# Altium project iMX6 Rex_V1I1.PrjPcb (part 3 of 3)

## Sheet [12] - CPU - UNUSED.SchDoc
size A2; DocumentNumber: 12; SheetNumber: 12; SheetTotal: 20
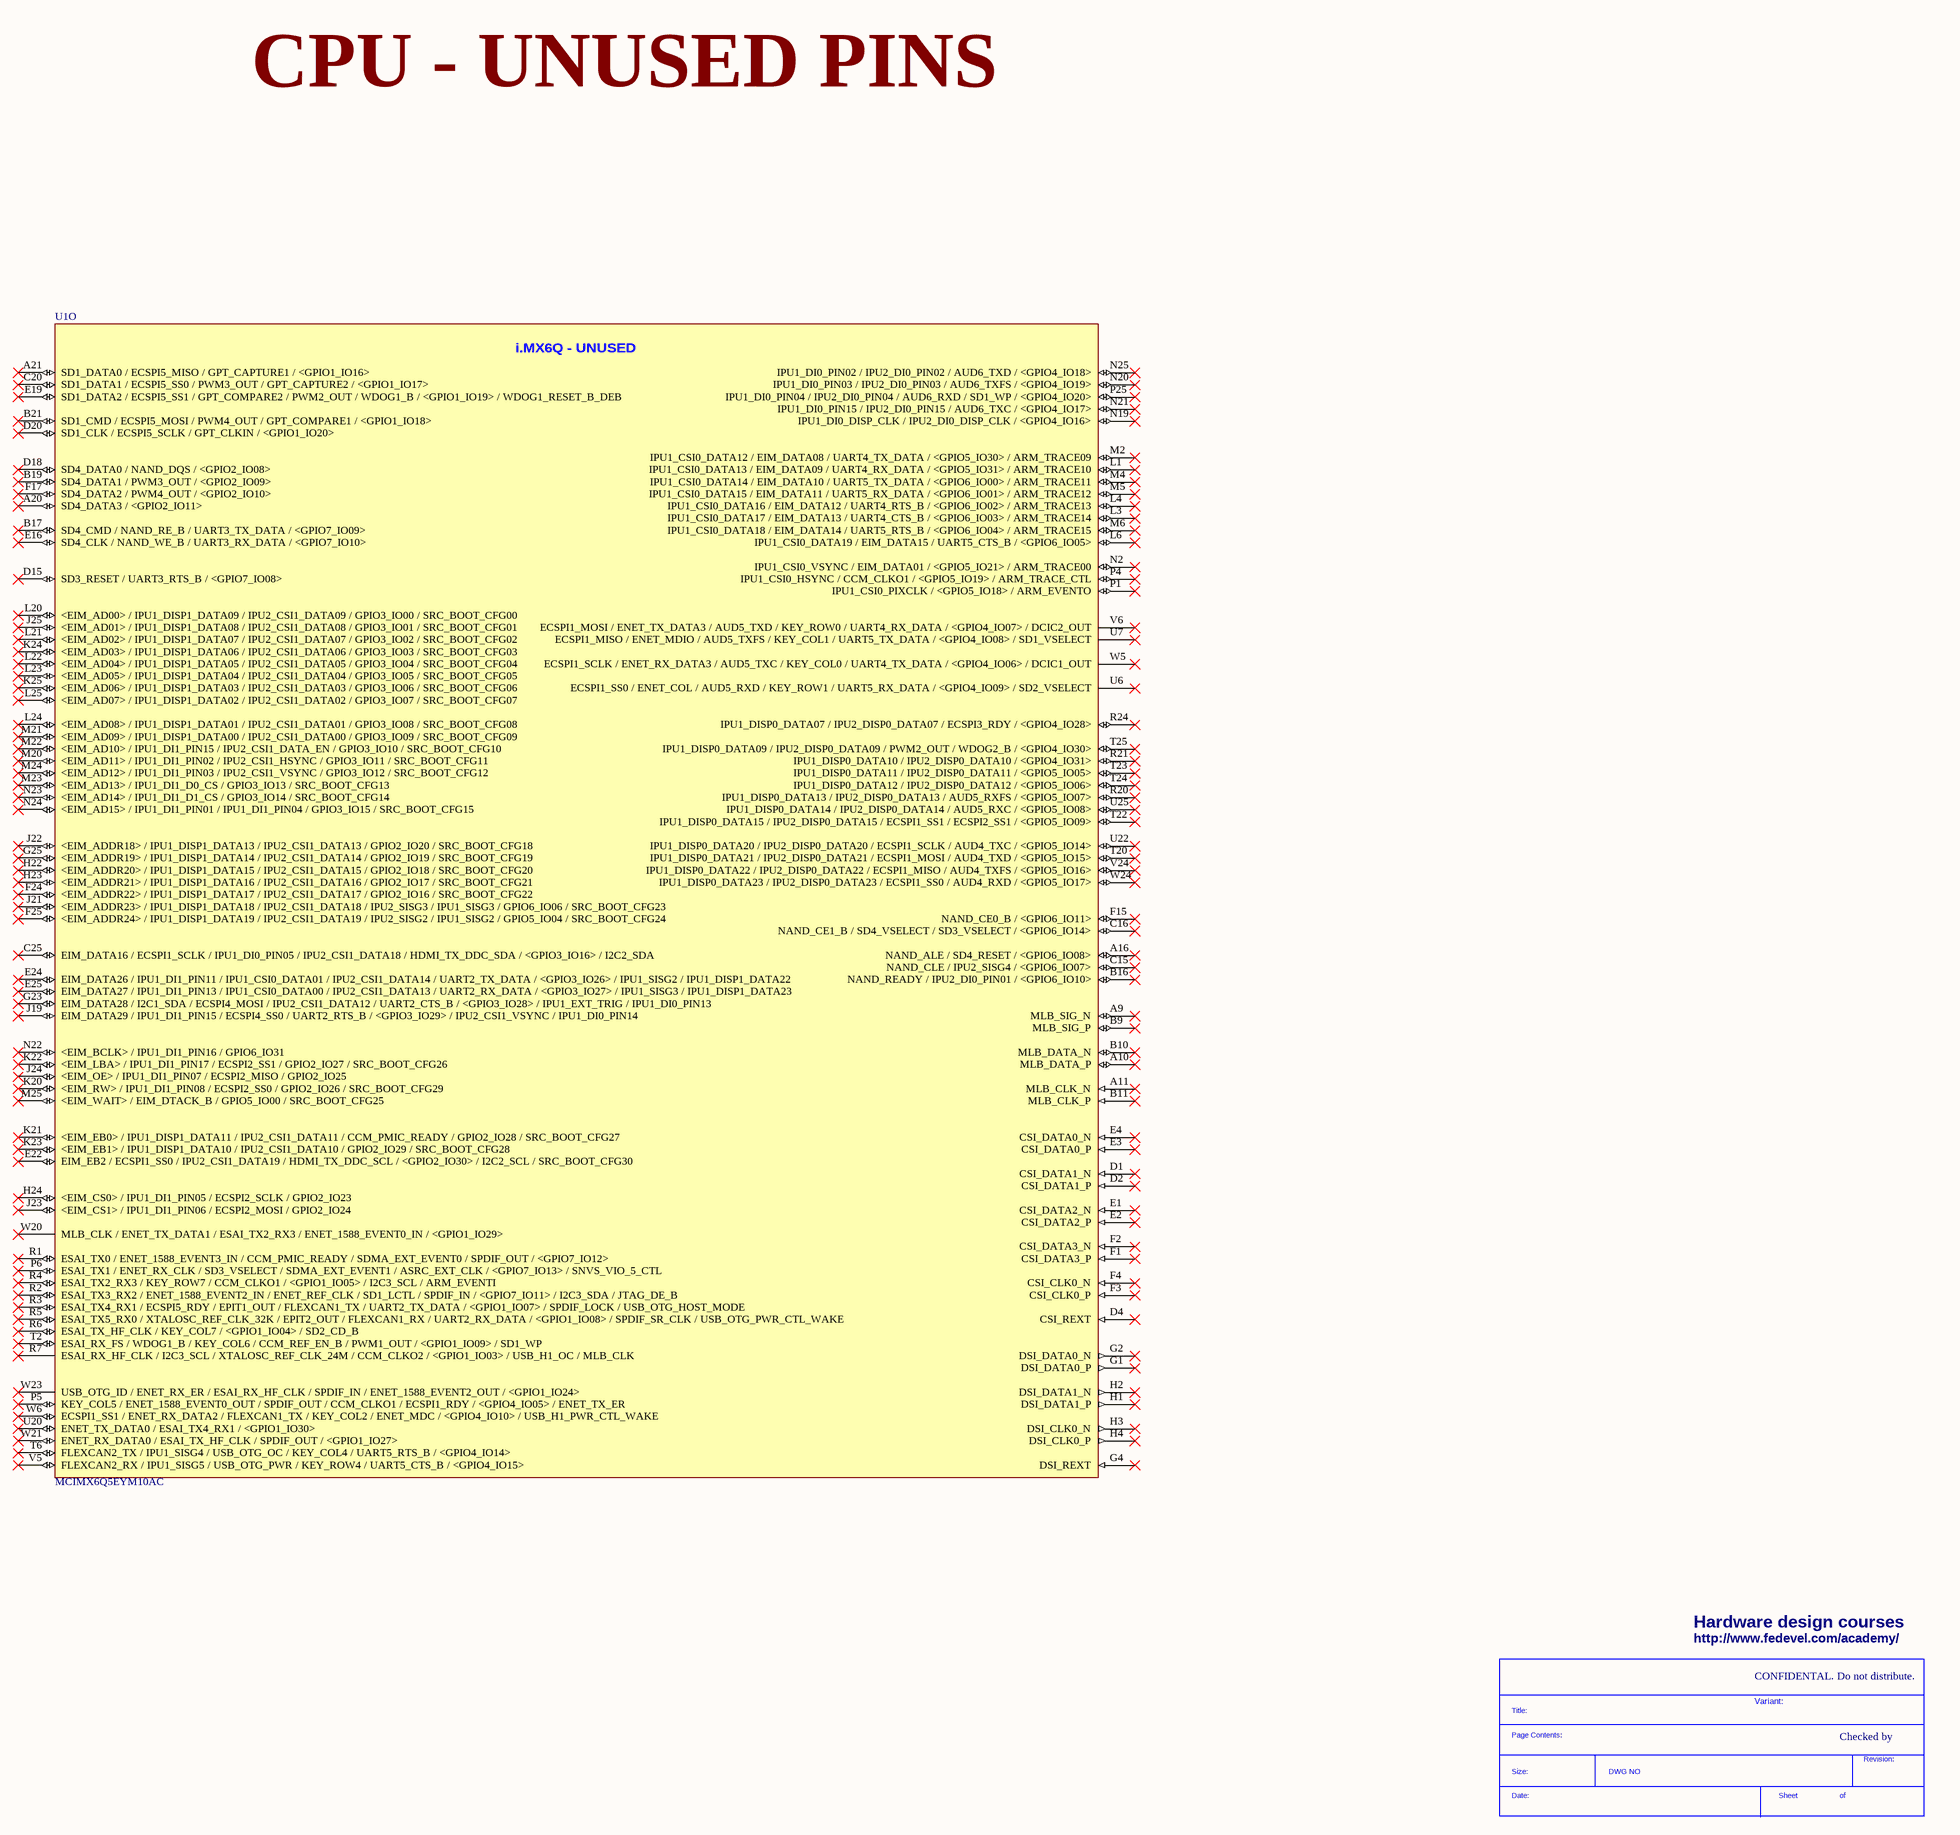
[diagram p11: [12] - CPU - UNUSED.SchDoc]

### Parts
(Parts that share a designator on the sheet are numbered #1, #2 ... from top to bottom, then left to right.)
*#7  SDTitleBlock  (value not drawn)  (graphical)
U1  MCIMX6Q5EYM10AC  [PBGA624]  (part O of 15)

### Nets

Not connected (* = marked no-connect by the designer): U1 A9(MLB_SIG_N)* A10(MLB_DATA_P)* A11(MLB_CLK_N)* A16(NAND_ALE_/_SD4_RESET_/_<GPIO6_IO08>)* A20(SD4_DATA3_/_<GPIO2_IO11>)* A21(SD1_DATA0_/_ECSPI5_MISO_/_GPT_CAPTURE1_/_<GPIO1_IO16>)* B9(MLB_SIG_P)* B10(MLB_DATA_N)* B11(MLB_CLK_P)* B16(NAND_READY_/_IPU2_DI0_PIN01_/_<GPIO6_IO10>)* B17(SD4_CMD_/_NAND_RE_B_/_UART3_TX_DATA_/_<GPIO7_IO09>)* B19(SD4_DATA1_/_PWM3_OUT_/_<GPIO2_IO09>)* B21(SD1_CMD_/_ECSPI5_MOSI_/_PWM4_OUT_/_GPT_COMPARE1_/_<GPIO1_IO18>)* C15(NAND_CLE_/_IPU2_SISG4_/_<GPIO6_IO07>)* C16(NAND_CE1_B_/_SD4_VSELECT_/_SD3_VSELECT_/_<GPIO6_IO14>)* C20(SD1_DATA1_/_ECSPI5_SS0_/_PWM3_OUT_/_GPT_CAPTURE2_/_<GPIO1_IO17>)* C25(EIM_DATA16_/_ECSPI1_SCLK_/_IPU1_DI0_PIN05_/_IPU2_CSI1_DATA18_/_HDMI_TX_DDC_SDA_/_<GPIO3_IO16>_/_I2C2_SDA)* D1(CSI_DATA1_N)* D2(CSI_DATA1_P)* D4(CSI_REXT)* D15(SD3_RESET_/_UART3_RTS_B_/_<GPIO7_IO08>)* D18(SD4_DATA0_/_NAND_DQS_/_<GPIO2_IO08>)* D20(SD1_CLK_/_ECSPI5_SCLK_/_GPT_CLKIN_/_<GPIO1_IO20>)* E1(CSI_DATA2_N)* E2(CSI_DATA2_P)* E3(CSI_DATA0_P)* E4(CSI_DATA0_N)* E16(SD4_CLK_/_NAND_WE_B_/_UART3_RX_DATA_/_<GPIO7_IO10>)* E19(SD1_DATA2_/_ECSPI5_SS1_/_GPT_COMPARE2_/_PWM2_OUT_/_WDOG1_B_/_<GPIO1_IO19>_/_WDOG1_RESET_B_DEB)* E22(EIM_EB2_/_ECSPI1_SS0_/_IPU2_CSI1_DATA19_/_HDMI_TX_DDC_SCL_/_<GPIO2_IO30>_/_I2C2_SCL_/_SRC_BOOT_CFG30)* E24(EIM_DATA26_/_IPU1_DI1_PIN11_/_IPU1_CSI0_DATA01_/_IPU2_CSI1_DATA14_/_UART2_TX_DATA_/_<GPIO3_IO26>_/_IPU1_SISG2_/_IPU1_DISP1_DATA22)* E25(EIM_DATA27_/_IPU1_DI1_PIN13_/_IPU1_CSI0_DATA00_/_IPU2_CSI1_DATA13_/_UART2_RX_DATA_/_<GPIO3_IO27>_/_IPU1_SISG3_/_IPU1_DISP1_DATA23)* F1(CSI_DATA3_P)* F2(CSI_DATA3_N)* F3(CSI_CLK0_P)* F4(CSI_CLK0_N)* F15(NAND_CE0_B_/_<GPIO6_IO11>)* F17(SD4_DATA2_/_PWM4_OUT_/_<GPIO2_IO10>)* F24(<EIM_ADDR22>_/_IPU1_DISP1_DATA17_/_IPU2_CSI1_DATA17_/_GPIO2_IO16_/_SRC_BOOT_CFG22)* F25(<EIM_ADDR24>_/_IPU1_DISP1_DATA19_/_IPU2_CSI1_DATA19_/_IPU2_SISG2_/_IPU1_SISG2_/_GPIO5_IO04_/_SRC_BOOT_CFG24)* G1(DSI_DATA0_P)* G2(DSI_DATA0_N)* G4(DSI_REXT)* G23(EIM_DATA28_/_I2C1_SDA_/_ECSPI4_MOSI_/_IPU2_CSI1_DATA12_/_UART2_CTS_B_/_<GPIO3_IO28>_/_IPU1_EXT_TRIG_/_IPU1_DI0_PIN13)* G25(<EIM_ADDR19>_/_IPU1_DISP1_DATA14_/_IPU2_CSI1_DATA14_/_GPIO2_IO19_/_SRC_BOOT_CFG19)* H1(DSI_DATA1_P)* H2(DSI_DATA1_N)* H3(DSI_CLK0_N)* H4(DSI_CLK0_P)* H22(<EIM_ADDR20>_/_IPU1_DISP1_DATA15_/_IPU2_CSI1_DATA15_/_GPIO2_IO18_/_SRC_BOOT_CFG20)* H23(<EIM_ADDR21>_/_IPU1_DISP1_DATA16_/_IPU2_CSI1_DATA16_/_GPIO2_IO17_/_SRC_BOOT_CFG21)* H24(<EIM_CS0>_/_IPU1_DI1_PIN05_/_ECSPI2_SCLK_/_GPIO2_IO23)* J19(EIM_DATA29_/_IPU1_DI1_PIN15_/_ECSPI4_SS0_/_UART2_RTS_B_/_<GPIO3_IO29>_/_IPU2_CSI1_VSYNC_/_IPU1_DI0_PIN14)* J21(<EIM_ADDR23>_/_IPU1_DISP1_DATA18_/_IPU2_CSI1_DATA18_/_IPU2_SISG3_/_IPU1_SISG3_/_GPIO6_IO06_/_SRC_BOOT_CFG23)* J22(<EIM_ADDR18>_/_IPU1_DISP1_DATA13_/_IPU2_CSI1_DATA13_/_GPIO2_IO20_/_SRC_BOOT_CFG18)* J23(<EIM_CS1>_/_IPU1_DI1_PIN06_/_ECSPI2_MOSI_/_GPIO2_IO24)* J24(<EIM_OE>_/_IPU1_DI1_PIN07_/_ECSPI2_MISO_/_GPIO2_IO25)* J25(<EIM_AD01>_/_IPU1_DISP1_DATA08_/_IPU2_CSI1_DATA08_/_GPIO3_IO01_/_SRC_BOOT_CFG01)* K20(<EIM_RW>_/_IPU1_DI1_PIN08_/_ECSPI2_SS0_/_GPIO2_IO26_/_SRC_BOOT_CFG29)* K21(<EIM_EB0>_/_IPU1_DISP1_DATA11_/_IPU2_CSI1_DATA11_/_CCM_PMIC_READY_/_GPIO2_IO28_/_SRC_BOOT_CFG27)* K22(<EIM_LBA>_/_IPU1_DI1_PIN17_/_ECSPI2_SS1_/_GPIO2_IO27_/_SRC_BOOT_CFG26)* K23(<EIM_EB1>_/_IPU1_DISP1_DATA10_/_IPU2_CSI1_DATA10_/_GPIO2_IO29_/_SRC_BOOT_CFG28)* K24(<EIM_AD03>_/_IPU1_DISP1_DATA06_/_IPU2_CSI1_DATA06_/_GPIO3_IO03_/_SRC_BOOT_CFG03)* K25(<EIM_AD06>_/_IPU1_DISP1_DATA03_/_IPU2_CSI1_DATA03_/_GPIO3_IO06_/_SRC_BOOT_CFG06)* L1(IPU1_CSI0_DATA13_/_EIM_DATA09_/_UART4_RX_DATA_/_<GPIO5_IO31>_/_ARM_TRACE10)* L3(IPU1_CSI0_DATA17_/_EIM_DATA13_/_UART4_CTS_B_/_<GPIO6_IO03>_/_ARM_TRACE14)* L4(IPU1_CSI0_DATA16_/_EIM_DATA12_/_UART4_RTS_B_/_<GPIO6_IO02>_/_ARM_TRACE13)* L6(IPU1_CSI0_DATA19_/_EIM_DATA15_/_UART5_CTS_B_/_<GPIO6_IO05>)* L20(<EIM_AD00>_/_IPU1_DISP1_DATA09_/_IPU2_CSI1_DATA09_/_GPIO3_IO00_/_SRC_BOOT_CFG00)* L21(<EIM_AD02>_/_IPU1_DISP1_DATA07_/_IPU2_CSI1_DATA07_/_GPIO3_IO02_/_SRC_BOOT_CFG02)* L22(<EIM_AD04>_/_IPU1_DISP1_DATA05_/_IPU2_CSI1_DATA05_/_GPIO3_IO04_/_SRC_BOOT_CFG04)* L23(<EIM_AD05>_/_IPU1_DISP1_DATA04_/_IPU2_CSI1_DATA04_/_GPIO3_IO05_/_SRC_BOOT_CFG05)* L24(<EIM_AD08>_/_IPU1_DISP1_DATA01_/_IPU2_CSI1_DATA01_/_GPIO3_IO08_/_SRC_BOOT_CFG08)* L25(<EIM_AD07>_/_IPU1_DISP1_DATA02_/_IPU2_CSI1_DATA02_/_GPIO3_IO07_/_SRC_BOOT_CFG07)* M2(IPU1_CSI0_DATA12_/_EIM_DATA08_/_UART4_TX_DATA_/_<GPIO5_IO30>_/_ARM_TRACE09)* M4(IPU1_CSI0_DATA14_/_EIM_DATA10_/_UART5_TX_DATA_/_<GPIO6_IO00>_/_ARM_TRACE11)* M5(IPU1_CSI0_DATA15_/_EIM_DATA11_/_UART5_RX_DATA_/_<GPIO6_IO01>_/_ARM_TRACE12)* M6(IPU1_CSI0_DATA18_/_EIM_DATA14_/_UART5_RTS_B_/_<GPIO6_IO04>_/_ARM_TRACE15)* M20(<EIM_AD11>_/_IPU1_DI1_PIN02_/_IPU2_CSI1_HSYNC_/_GPIO3_IO11_/_SRC_BOOT_CFG11)* M21(<EIM_AD09>_/_IPU1_DISP1_DATA00_/_IPU2_CSI1_DATA00_/_GPIO3_IO09_/_SRC_BOOT_CFG09)* M22(<EIM_AD10>_/_IPU1_DI1_PIN15_/_IPU2_CSI1_DATA_EN_/_GPIO3_IO10_/_SRC_BOOT_CFG10)* M23(<EIM_AD13>_/_IPU1_DI1_D0_CS_/_GPIO3_IO13_/_SRC_BOOT_CFG13)* M24(<EIM_AD12>_/_IPU1_DI1_PIN03_/_IPU2_CSI1_VSYNC_/_GPIO3_IO12_/_SRC_BOOT_CFG12)* M25(<EIM_WAIT>_/_EIM_DTACK_B_/_GPIO5_IO00_/_SRC_BOOT_CFG25)* N2(IPU1_CSI0_VSYNC_/_EIM_DATA01_/_<GPIO5_IO21>_/_ARM_TRACE00)* N19(IPU1_DI0_DISP_CLK_/_IPU2_DI0_DISP_CLK_/_<GPIO4_IO16>)* N20(IPU1_DI0_PIN03_/_IPU2_DI0_PIN03_/_AUD6_TXFS_/_<GPIO4_IO19>)* N21(IPU1_DI0_PIN15_/_IPU2_DI0_PIN15_/_AUD6_TXC_/_<GPIO4_IO17>)* N22(<EIM_BCLK>_/_IPU1_DI1_PIN16_/_GPIO6_IO31)* N23(<EIM_AD14>_/_IPU1_DI1_D1_CS_/_GPIO3_IO14_/_SRC_BOOT_CFG14)* N24(<EIM_AD15>_/_IPU1_DI1_PIN01_/_IPU1_DI1_PIN04_/_GPIO3_IO15_/_SRC_BOOT_CFG15)* N25(IPU1_DI0_PIN02_/_IPU2_DI0_PIN02_/_AUD6_TXD_/_<GPIO4_IO18>)* P1(IPU1_CSI0_PIXCLK_/_<GPIO5_IO18>_/_ARM_EVENTO)* P4(IPU1_CSI0_HSYNC_/_CCM_CLKO1_/_<GPIO5_IO19>_/_ARM_TRACE_CTL)* P5(KEY_COL5_/_ENET_1588_EVENT0_OUT_/_SPDIF_OUT_/_CCM_CLKO1_/_ECSPI1_RDY_/_<GPIO4_IO05>_/_ENET_TX_ER)* P6(ESAI_TX1_/_ENET_RX_CLK_/_SD3_VSELECT_/_SDMA_EXT_EVENT1_/_ASRC_EXT_CLK_/_<GPIO7_IO13>_/_SNVS_VIO_5_CTL)* P25(IPU1_DI0_PIN04_/_IPU2_DI0_PIN04_/_AUD6_RXD_/_SD1_WP_/_<GPIO4_IO20>)* R1(ESAI_TX0_/_ENET_1588_EVENT3_IN_/_CCM_PMIC_READY_/_SDMA_EXT_EVENT0_/_SPDIF_OUT_/_<GPIO7_IO12>)* R2(ESAI_TX3_RX2_/_ENET_1588_EVENT2_IN_/_ENET_REF_CLK_/_SD1_LCTL_/_SPDIF_IN_/_<GPIO7_IO11>_/_I2C3_SDA_/_JTAG_DE_B)* R3(ESAI_TX4_RX1_/_ECSPI5_RDY_/_EPIT1_OUT_/_FLEXCAN1_TX_/_UART2_TX_DATA_/_<GPIO1_IO07>_/_SPDIF_LOCK_/_USB_OTG_HOST_MODE)* R4(ESAI_TX2_RX3_/_KEY_ROW7_/_CCM_CLKO1_/_<GPIO1_IO05>_/_I2C3_SCL_/_ARM_EVENTI)* R5(ESAI_TX5_RX0_/_XTALOSC_REF_CLK_32K_/_EPIT2_OUT_/_FLEXCAN1_RX_/_UART2_RX_DATA_/_<GPIO1_IO08>_/_SPDIF_SR_CLK_/_USB_OTG_PWR_CTL_WAKE)* R6(ESAI_TX_HF_CLK_/_KEY_COL7_/_<GPIO1_IO04>_/_SD2_CD_B)* R7(ESAI_RX_HF_CLK_/_I2C3_SCL_/_XTALOSC_REF_CLK_24M_/_CCM_CLKO2_/_<GPIO1_IO03>_/_USB_H1_OC_/_MLB_CLK)* R20(IPU1_DISP0_DATA13_/_IPU2_DISP0_DATA13_/_AUD5_RXFS_/_<GPIO5_IO07>)* R21(IPU1_DISP0_DATA10_/_IPU2_DISP0_DATA10_/_<GPIO4_IO31>)* R24(IPU1_DISP0_DATA07_/_IPU2_DISP0_DATA07_/_ECSPI3_RDY_/_<GPIO4_IO28>)* T2(ESAI_RX_FS_/_WDOG1_B_/_KEY_COL6_/_CCM_REF_EN_B_/_PWM1_OUT_/_<GPIO1_IO09>_/_SD1_WP)* T6(FLEXCAN2_TX_/_IPU1_SISG4_/_USB_OTG_OC_/_KEY_COL4_/_UART5_RTS_B_/_<GPIO4_IO14>)* T20(IPU1_DISP0_DATA21_/_IPU2_DISP0_DATA21_/_ECSPI1_MOSI_/_AUD4_TXD_/_<GPIO5_IO15>)* T22(IPU1_DISP0_DATA15_/_IPU2_DISP0_DATA15_/_ECSPI1_SS1_/_ECSPI2_SS1_/_<GPIO5_IO09>)* T23(IPU1_DISP0_DATA11_/_IPU2_DISP0_DATA11_/_<GPIO5_IO05>)* T24(IPU1_DISP0_DATA12_/_IPU2_DISP0_DATA12_/_<GPIO5_IO06>)* T25(IPU1_DISP0_DATA09_/_IPU2_DISP0_DATA09_/_PWM2_OUT_/_WDOG2_B_/_<GPIO4_IO30>)* U6(ECSPI1_SS0_/_ENET_COL_/_AUD5_RXD_/_KEY_ROW1_/_UART5_RX_DATA_/_<GPIO4_IO09>_/_SD2_VSELECT)* U7(ECSPI1_MISO_/_ENET_MDIO_/_AUD5_TXFS_/_KEY_COL1_/_UART5_TX_DATA_/_<GPIO4_IO08>_/_SD1_VSELECT)* U20(ENET_TX_DATA0_/_ESAI_TX4_RX1_/_<GPIO1_IO30>)* U22(IPU1_DISP0_DATA20_/_IPU2_DISP0_DATA20_/_ECSPI1_SCLK_/_AUD4_TXC_/_<GPIO5_IO14>)* U25(IPU1_DISP0_DATA14_/_IPU2_DISP0_DATA14_/_AUD5_RXC_/_<GPIO5_IO08>)* V5(FLEXCAN2_RX_/_IPU1_SISG5_/_USB_OTG_PWR_/_KEY_ROW4_/_UART5_CTS_B_/_<GPIO4_IO15>)* V6(ECSPI1_MOSI_/_ENET_TX_DATA3_/_AUD5_TXD_/_KEY_ROW0_/_UART4_RX_DATA_/_<GPIO4_IO07>_/_DCIC2_OUT)* V24(IPU1_DISP0_DATA22_/_IPU2_DISP0_DATA22_/_ECSPI1_MISO_/_AUD4_TXFS_/_<GPIO5_IO16>)* W5(ECSPI1_SCLK_/_ENET_RX_DATA3_/_AUD5_TXC_/_KEY_COL0_/_UART4_TX_DATA_/_<GPIO4_IO06>_/_DCIC1_OUT)* W6(ECSPI1_SS1_/_ENET_RX_DATA2_/_FLEXCAN1_TX_/_KEY_COL2_/_ENET_MDC_/_<GPIO4_IO10>_/_USB_H1_PWR_CTL_WAKE)* W20(MLB_CLK_/_ENET_TX_DATA1_/_ESAI_TX2_RX3_/_ENET_1588_EVENT0_IN_/_<GPIO1_IO29>)* W21(ENET_RX_DATA0_/_ESAI_TX_HF_CLK_/_SPDIF_OUT_/_<GPIO1_IO27>)* W23(USB_OTG_ID_/_ENET_RX_ER_/_ESAI_RX_HF_CLK_/_SPDIF_IN_/_ENET_1588_EVENT2_OUT_/_<GPIO1_IO24>)* W24(IPU1_DISP0_DATA23_/_IPU2_DISP0_DATA23_/_ECSPI1_SS0_/_AUD4_RXD_/_<GPIO5_IO17>)*

### Notes on the sheet
- CPU - UNUSED PINS
- Hardware design courses
- http://www.fedevel.com/academy/
- CONFIDENTAL. Do not distribute.
- Variant:
- Checked by
- (in symbol MCIMX6Q5EYM10AC, part O) i.MX6Q - UNUSED
- (in symbol SDTitleBlock) Title:; Page Contents:; Revision:; Size:; DWG NO; Date:; Sheet; of

### Library data of the parts
U1 = MCIMX6Q5EYM10AC: IC MCU 32BIT ARM QUAD 624FCBGA; Manufacturer: Freescale Semiconductor; Core Processor: ARM® Cortex™-A9; Core Size: 32-Bit Quad-Core; Speed: 1.0GHz; Connectivity: CAN, EBI/EMI, ESAI, Ethernet, GPMI, I2C, MMC/SD, PCI, SATA, SPI, UART, USB, USB OTG; Peripherals: DMA, HDMI, I2S/SSI/AC97, MIPI CSI, MIMI DSI, MIPI HIS, PWM, WDT; Number of I /O: 224; Program Memory Type: External Program Memory; RAM Size: 256K x 8; Voltage - Supply (Vcc/Vdd): 0.925 V ~ 1.5 V; Oscillator Type: Internal; .Creator: MM; .Checked PCB: MM, checked by RF; Supplier 1: Digi-Key; Manufacturer Part Number: MCIMX6Q5EYM10AC; RoHS: RoHS Compliant; Category: Integrated Circuits (ICs); Stock 1: 0; Pricing 1: 1=54.98, 10=51.922, 25=48.868, 100=30.5424 (USD); Program Memory Size: -; EEPROM Size: -; Data Converters: -; Operating Temperature: -20°C ~ 105°C; Package / Case: 624-FBGA, FCBGA; Packaging: Tray; ComponentLink1URL: http://cache.freescale.com/files/32bit/doc/data_sheet/IMX6DQCEC.pdf; ComponentLink1Description: http://cache.freescale.com/files/32bit/doc/data_sheet/IMX6DQCEC.pdf; Supplier Part Number 1: MCIMX6Q5EYM10AC-ND; .Checked SCH: MM

## Sheet [14] - SPI FLASH, LEDS.SchDoc
size A2; DocumentNumber: 14; SheetNumber: 14; SheetTotal: 20
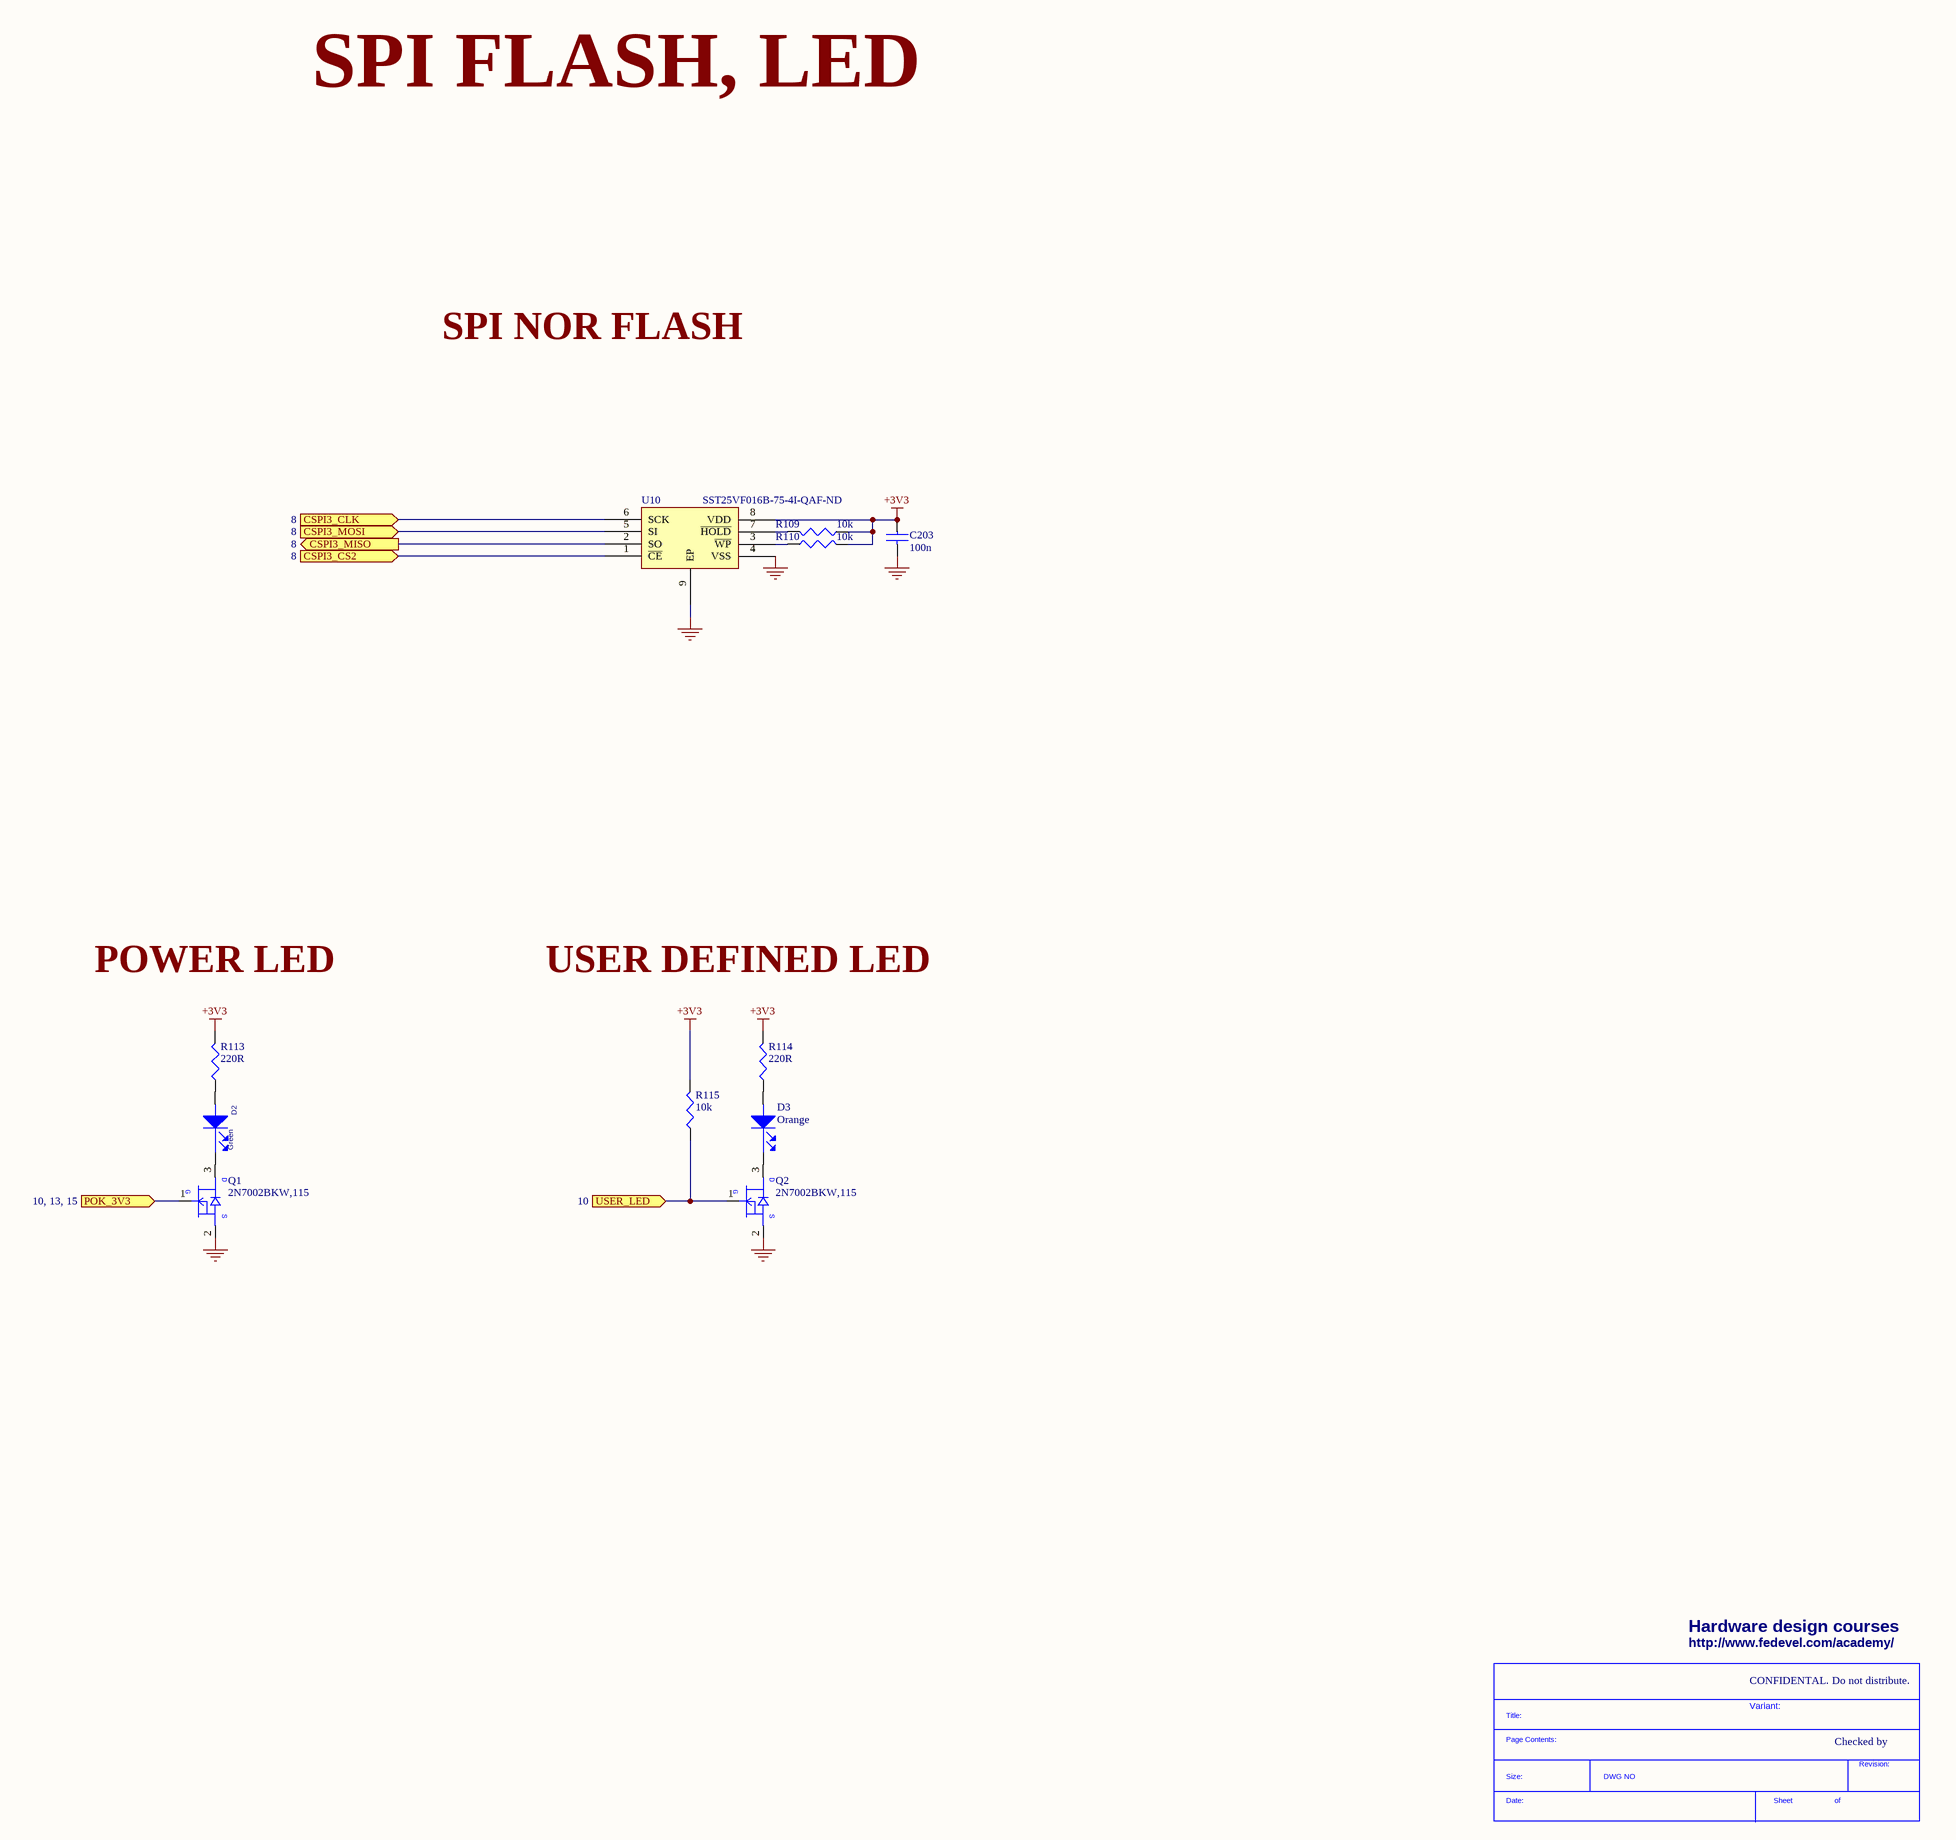
[diagram p12: [14] - SPI FLASH, LEDS.SchDoc]

### Parts
(Parts that share a designator on the sheet are numbered #1, #2 ... from top to bottom, then left to right.)
*#8  SDTitleBlock  (value not drawn)  (graphical)
C203  100n  [C0402]
D2  Green  [LED_0603]
D3  Orange  [LED_0603]
Q1  2N7002BKW,115  [SC70_SOT323]
Q2  2N7002BKW,115  [SC70_SOT323]
R109  10k  [R0402]
R110  10k  [R0402]
R113  220R  [R0402]
R114  220R  [R0402]
R115  10k  [R0402]
U10  SST25VF016B-75-4I-QAF-ND  [WSON8_6X5MM]

### Ports
CSPI3_CLK (in, see 8), CSPI3_CS2 (in, see 8), CSPI3_MISO (out, see 8), CSPI3_MOSI (in, see 8), POK_3V3 (see 10, 13, 15), USER_LED (in, see 10)

### Nets
+3V3: C203.1 R109.1 R110.2 R113.2 R114.2 R115.2 U10.8(VDD)
GND: C203.2 Q1.2(SOURCE) Q2.2(SOURCE) U10.4(VSS) U10.9(EP)
CSPI3_CLK: U10.6(SCK) ; port CSPI3_CLK
CSPI3_CS2: U10.1(~{CE}) ; port CSPI3_CS2
CSPI3_MISO: U10.2(SO) ; port CSPI3_MISO
CSPI3_MOSI: U10.5(SI) ; port CSPI3_MOSI
POK_3V3: Q1.1(GATE) ; port POK_3V3
USER_LED: Q2.1(GATE) R115.1 ; port USER_LED
NetD2_1: D2.1(cathode) Q1.3(DRAIN)
NetD2_2: D2.2(ANODE) R113.1
NetD3_1: D3.1(cathode) Q2.3(DRAIN)
NetD3_2: D3.2(ANODE) R114.1
NetR109_2: R109.2 U10.7(~{HOLD})
NetR110_1: R110.1 U10.3(~{WP})

### Notes on the sheet
- SPI FLASH, LED
- SPI NOR FLASH
- POWER LED
- USER DEFINED LED
- Hardware design courses
- http://www.fedevel.com/academy/
- CONFIDENTAL. Do not distribute.
- Variant:
- Checked by
- (in symbol 2N7002BKW,115) D; G; S
- (in symbol SDTitleBlock) Title:; Page Contents:; Revision:; Size:; DWG NO; Date:; Sheet; of

### Library data of the parts
C203 = C1005X5R1H104K: CAP CER .10UF 50V X5R 10% 0402; Manufacturer: TDK Corporation; Capacitance: 0.1µF; Value: 100nF; .Checked PCB: used; Description: CAP CER 0.1UF 50V 10% X5R 0402; Category: Capacitors; Manufacturer Part Number: C1005X5R1H104K; Operating Temperature: -55°C ~ 85°C; Package / Case: 0402 (1005 Metric); Price 1k [$]: 0.02340; .Checked SCH: used; Voltage - Rated: 50V; Supplier Part Number: 445-5942-1-ND; Supplier: Digikey; Supplier 1: Digi-Key; Supplier Part Number 1: 445-5942-1-ND; RoHS: RoHS Compliant; Stock 1: 106926; Pricing 1: 1=0.27, 10=0.18, 100=0.072, 250=0.05176, 500=0.0369, 1000=0.027 (USD); Tolerance: ±10%; Temperature Coefficient: X5R; Mounting Type: Surface Mount, MLCC; Applications: General Purpose; Ratings: -; Size / Dimension: 0.039" L x 0.020" W (1.00mm x 0.50mm); Height - Seated (Max): -; Thickness (Max): 0.022" (0.55mm); Lead Spacing: -; Features: -; Packaging: Cut Tape (CT); Lead Style: -; ComponentLink1URL: http://www.tdk.co.jp/tefe02/e412_c.pdf; ComponentLink1Description: http://www.tdk.co.jp/tefe02/e412_c.pdf
D2 = LG L29K-G2J1-24-Z: LED SMARTLED GREEN 570NM 0603; Manufacturer: OSRAM Opto Semiconductors Inc; .Checked PCB: used; Current - Test: 2mA; Voltage - Forward (Vf) Typ: 1.7V; Luminous Flux @ Current - Test: 12 mlm; Millicandela Rating: 3.92mcd; Wavelength - Peak: 572nm; Lens Type: Diffused; Lens Style/Size: Rectangle with Flat Top, 1.3mm x 0.8mm; Viewing Angle: 160°; Regulator Topology: Positive Fixed; Voltage - Output: 2.5V; Voltage - Input: 2.6 V ~ 6 V; Voltage - Dropout (Typical): 0.16V @ 500mA; Number of Regulators: 1; Current - Output: 500mA; Current - Limit (Min): 600mA; .Checked SCH: used; Category: Optoelectronics; Family: LEDs - <75mA, Discre; Manufacturer Part Number: LG L29K-G2J1-24-Z; Price 1k [$]: 0.08744; Value: Green; Color: Green; Package / Case: 0603 (1608 Metric); Supplier Part Number: 475-2709-1-ND; Supplier: Digikey; Supplier 1: Digi-Key; Supplier Part Number 1: 475-2709-1-ND; RoHS: RoHS Compliant; Stock 1: 30318; Pricing 1: 1=0.16, 10=0.137, 100=0.1093, 250=0.09564, 500=0.08744 (USD); Wavelength - Dominant: 570nm; Size / Dimension: 1.70mm L x 0.80mm W; Height: 0.65mm; Mounting Type: Surface Mount; Packaging: Cut Tape (CT); ComponentLink1URL: http://catalog.osram-os.com/catalogue/catalogue.do;jsessionid=32CB61882C089EDD4B6D0A54E7E1F117?act=downloadFile&favOid=020000020000138e000100b6; ComponentLink1Description: http://catalog.osram-os.com/catalogue/catalogue.do;jsessionid=32CB61882C089EDD4B6D0A54E7E1F117?act=downloadFile&favOid=020000020000138e000100b6; Operating Temperature: -40°C ~ 125°C; Supplier Device Package: 6-TMLF® (1.6x1.6); ComponentLink2URL: http://www.micrel.com/_PDF/mic5353.pdf; ComponentLink2Description: http://www.micrel.com/_PDF/mic5353.pdf
D3 = LO L29K-H2K1-24-Z: LED SMARTLED ORANGE 606NM 0603; Manufacturer: OSRAM Opto Semiconductors Inc; Millicandela Rating: 6.3mcd; Voltage - Forward (Vf) Typ: 1.8V; Current - Test: 2mA; Wavelength - Peak: 610nm; Viewing Angle: 160°; Lens Type: Diffused; Lens Style/Size: Rectangle with Flat Top, 1.3mm x 0.8mm; Luminous Flux @ Current - Test: 25 mlm; .Checked PCB: RF; Supplier 1: Digi-Key; Supplier Part Number 1: 475-2740-1-ND; Manufacturer Part Number: LO L29K-H2K1-24-Z; RoHS: RoHS Compliant; Category: Optoelectronics; Stock 1: 15900; Pricing 1: 1=0.17, 10=0.141, 100=0.1127, 250=0.0986, 500=0.09016 (USD); Color: Orange; Wavelength - Dominant: 606nm; Package / Case: 0603 (1608 Metric); Size / Dimension: 1.70mm L x 0.80mm W; Height: 0.65mm; Mounting Type: Surface Mount; Packaging: Cut Tape (CT); ComponentLink1URL: http://catalog.osram-os.com/catalogue/catalogue.do;jsessionid=302CF83AF637AE24E40AEB0ADA267EDD?act=downloadFile&favOid=020000010003f9de000100b6; ComponentLink1Description: http://catalog.osram-os.com/catalogue/catalogue.do;jsessionid=302CF83AF637AE24E40AEB0ADA267EDD?act=downloadFile&favOid=020000010003f9de000100b6; .Checked SCH: RF
Q1 Q2 = 2N7002BKW,115: MOSFET N-CH 60V 310MA SOT323; Manufacturer: NXP Semiconductors; FET Type: MOSFET N-Channel, Metal Oxide; FET Feature: Logic Level Gate; Rds On (Max) @ Id, Vgs: 1.6 Ohm @ 500mA, 10V; Vgs(th) (Max) @ Id: 2.1V @ 250µA; Gate Charge (Qg) @ Vgs: 0.6nC @ 4.5V; Input Capacitance (Ciss) @ Vds: 50pF @ 10V; Power - Max: 275mW; .Checked PCB: RF; Supplier 1: Digi-Key; Supplier Part Number 1: 568-5980-1-ND; Manufacturer Part Number: 2N7002BKW,115; RoHS: RoHS Compliant; Category: Discrete Semiconductor Products; Stock 1: 15666; Pricing 1: 1=0.39, 10=0.354, 25=0.2548, 100=0.1983, 250=0.12456, 500=0.10616, 1000=0.07233 (USD); Drain to Source Voltage (Vdss): 60V; Current - Continuous Drain (Id) @ 25° C: 310mA; Mounting Type: Surface Mount; Package / Case: SC-70, SOT-323; Supplier Device Package: SC-70; Packaging: Cut Tape (CT); ComponentLink1URL: http://www.nxp.com/documents/data_sheet/2N7002BKW.pdf; ComponentLink1Description: http://www.nxp.com/documents/data_sheet/2N7002BKW.pdf; .Checked SCH: RF
R109 R110 R115 = RC0402FR-0710KL: RES 10.0K OHM 1/16W 1% 0402 SMD; Manufacturer: Yageo; Power (Watts): 0.063W, 1/16W; .Checked PCB: used; Temperature Coefficient: ±100ppm/°C; Category: Resistors; Manufacturer Part Number: RC0402FR-0710KL; Package / Case: 0402 (1005 Metric); Price 1k [$]: 0.01421; Resistance (Ohms): 10K; Tolerance: ±1%; Value: 10k; .Checked SCH: used; Supplier Part Number: 311-10.0KLRCT-ND; Supplier: Digikey; Supplier 1: Digi-Key; Supplier Part Number 1: 311-10.0KLRCT-ND; RoHS: RoHS Compliant; Stock 1: 2916495; Pricing 1: 10=0.014, 50=0.0104, 100=0.0079, 250=0.00584, 500=0.00432, 1000=0.00288 (USD); Composition: Thick Film; Features: -; Size / Dimension: 0.039" L x 0.020" W (1.00mm x 0.50mm); Height: 0.016" (0.40mm); Number of Terminations: 2; Packaging: Cut Tape (CT); ComponentLink1URL: http://www.yageo.com/documents/recent/PYu-RC0402_51_RoHS_L_6.pdf; ComponentLink1Description: http://www.yageo.com/documents/recent/PYu-RC0402_51_RoHS_L_6.pdf
R113 R114 = RC0402FR-07220RL: RES 220 OHM 1/16W 1% 0402 SMD; Manufacturer: Yageo; Resistance (Ohms): 220; Power (Watts): 0.063W, 1/16W; .Checked PCB: used; Temperature Coefficient: ±100ppm/°C; Category: Resistors; Manufacturer Part Number: RC0402FR-07220RL; Package / Case: 0402 (1005 Metric); Price 1k [$]: 0.01421; Tolerance: ±1%; Value: 220R; .Checked SCH: used; Supplier Part Number: 311-220LRCT-ND; Supplier: Digikey; Supplier 1: Digi-Key; Supplier Part Number 1: 311-220LRCT-ND; RoHS: RoHS Compliant; Stock 1: 276463; Pricing 1: 10=0.014, 50=0.0104, 100=0.0079, 250=0.00584, 500=0.00432, 1000=0.00288 (USD); Composition: Thick Film; Features: -; Size / Dimension: 0.039" L x 0.020" W (1.00mm x 0.50mm); Height: 0.016" (0.40mm); Number of Terminations: 2; Packaging: Cut Tape (CT); ComponentLink1URL: http://www.yageo.com/documents/recent/PYu-RC0402_51_RoHS_L_6.pdf; ComponentLink1Description: http://www.yageo.com/documents/recent/PYu-RC0402_51_RoHS_L_6.pdf
U10 = SST25VF016B-75-4I-QAF: IC FLASH 16MBIT 75MHZ 8WSON; Manufacturer: Microchip Technology; Memory Size: 16M (2M x 8); Interface: SPI Serial; Voltage - Supply: 2.7 V ~ 3.6 V; .Creator: MM; .Checked PCB: MM, checked by RF; Supplier 1: Digi-Key; Manufacturer Part Number: SST25VF016B-75-4I-QAF; RoHS: RoHS Compliant; Category: Integrated Circuits (ICs); Stock 1: 433; Pricing 1: 1=1.58, 10=1.512, 25=1.4492, 100=1.16, 500=0.97, 1000=0.925 (USD); Packaging: Tube; Format - Memory: FLASH; Memory Type: FLASH; Speed: 75MHz; Operating Temperature: -40°C ~ 85°C; Package / Case: 8-WSON; Supplier Device Package: 8-WSON; ComponentLink1URL: http://ww1.microchip.com/downloads/en/DeviceDoc/25044A.pdf; ComponentLink1Description: http://ww1.microchip.com/downloads/en/DeviceDoc/25044A.pdf; Supplier Part Number 1: SST25VF016B-75-4I-QAF-ND; .Checked SCH: MM, checked by RF

## Nets that join several sheets
+3V3: [03] - CONNECTORS (C1.1 J2.50), [06] - CPU - HDMI, LVDS (7 pins), [07] - CPU - USB, ETHERNET (R100.2), [08] - CPU - SPI, I2C, SD, MMC (8 pins), [09] - CPU - UART, AUDIO (R46.2 R47.2), [14] - SPI FLASH, LEDS (7 pins)
+5V_USB_VBUS: [03] - CONNECTORS (C242.1 J1.18), [07] - CPU - USB, ETHERNET (C79.1 C82.1 U1.D10 U1.E9)
GND: [03] - CONNECTORS (16 pins), [04] - CPU - DDR3, DDR3 MEM (149 pins), [06] - CPU - HDMI, LVDS (9 pins), [07] - CPU - USB, ETHERNET (C79.2 C80.2 C81.2 C82.2), [14] - SPI FLASH, LEDS (5 pins)
AUD3_CLK: [03] - CONNECTORS (J2.20), [09] - CPU - UART, AUDIO (R160.2)
AUD3_RXD: [03] - CONNECTORS (J2.22), [09] - CPU - UART, AUDIO (U1.N3)
AUD3_TXC: [03] - CONNECTORS (J2.16), [09] - CPU - UART, AUDIO (R72.2)
AUD3_TXD: [03] - CONNECTORS (J2.18), [09] - CPU - UART, AUDIO (U1.P2)
AUD3_TXFS: [03] - CONNECTORS (J2.24), [09] - CPU - UART, AUDIO (U1.N4)
CPU_GPIO0: [03] - CONNECTORS (J1.35), [08] - CPU - SPI, I2C, SD, MMC (R45.1 R157.1 U1.E15)
CPU_GPIO1: [03] - CONNECTORS (J1.37), [08] - CPU - SPI, I2C, SD, MMC (R44.1 R156.1 U1.D16)
CSPI2_CLK: [03] - CONNECTORS (J1.17), [08] - CPU - SPI, I2C, SD, MMC (R159.2)
CSPI2_CS0: [03] - CONNECTORS (J1.19), [08] - CPU - SPI, I2C, SD, MMC (U1.V25)
CSPI2_MISO: [03] - CONNECTORS (J1.21), [08] - CPU - SPI, I2C, SD, MMC (U1.U24)
CSPI2_MOSI: [03] - CONNECTORS (J1.23), [08] - CPU - SPI, I2C, SD, MMC (U1.T21)
CSPI3_CLK: [08] - CPU - SPI, I2C, SD, MMC (R112.2), [14] - SPI FLASH, LEDS (U10.6)
CSPI3_CS2: [08] - CPU - SPI, I2C, SD, MMC (U1.R25), [14] - SPI FLASH, LEDS (U10.1)
CSPI3_MISO: [08] - CPU - SPI, I2C, SD, MMC (U1.P23), [14] - SPI FLASH, LEDS (U10.2)
CSPI3_MOSI: [08] - CPU - SPI, I2C, SD, MMC (U1.P22), [14] - SPI FLASH, LEDS (U10.5)
HDMI_CEC_IN: [03] - CONNECTORS (J1.44), [06] - CPU - HDMI, LVDS (R22.1 R24.2 R25.2)
HDMI_CLK_N: [03] - CONNECTORS (J1.45), [06] - CPU - HDMI, LVDS (U1.J5)
HDMI_CLK_P: [03] - CONNECTORS (J1.47), [06] - CPU - HDMI, LVDS (U1.J6)
HDMI_D0_N: [03] - CONNECTORS (J1.39), [06] - CPU - HDMI, LVDS (U1.K5)
HDMI_D0_P: [03] - CONNECTORS (J1.41), [06] - CPU - HDMI, LVDS (U1.K6)
HDMI_D1_N: [03] - CONNECTORS (J1.46), [06] - CPU - HDMI, LVDS (U1.J3)
HDMI_D1_P: [03] - CONNECTORS (J1.48), [06] - CPU - HDMI, LVDS (U1.J4)
HDMI_D2_N: [03] - CONNECTORS (J1.40), [06] - CPU - HDMI, LVDS (U1.K3)
HDMI_D2_P: [03] - CONNECTORS (J1.42), [06] - CPU - HDMI, LVDS (U1.K4)
HDMI_HPD: [03] - CONNECTORS (J1.43), [06] - CPU - HDMI, LVDS (C74.2 R21.1 U1.K1)
I2C1_SCL: [03] - CONNECTORS (J2.14), [09] - CPU - UART, AUDIO (R47.1 U1.N5)
I2C1_SDA: [03] - CONNECTORS (J2.12), [09] - CPU - UART, AUDIO (R46.1 U1.N6)
I2C2_SCL: [03] - CONNECTORS (J1.36), [06] - CPU - HDMI, LVDS (R28.1 U1.U5)
I2C2_SDA: [03] - CONNECTORS (J1.38), [06] - CPU - HDMI, LVDS (R29.1 U1.T7)
I2C3_SCL: [03] - CONNECTORS (J2.19), [06] - CPU - HDMI, LVDS (R31.1 U1.F21), [08] - CPU - SPI, I2C, SD, MMC (R157.2)
I2C3_SDA: [03] - CONNECTORS (J2.17), [06] - CPU - HDMI, LVDS (R32.1 U1.D24), [08] - CPU - SPI, I2C, SD, MMC (R156.2)
LVDS0_CABC: [03] - CONNECTORS (J2.6), [06] - CPU - HDMI, LVDS (R33.1 U1.A17)
LVDS0_CLK_N: [03] - CONNECTORS (J2.13), [06] - CPU - HDMI, LVDS (U1.V4)
LVDS0_CLK_P: [03] - CONNECTORS (J2.15), [06] - CPU - HDMI, LVDS (U1.V3)
LVDS0_PWM: [03] - CONNECTORS (J2.5), [06] - CPU - HDMI, LVDS (U1.F18)
LVDS0_TX0_N: [03] - CONNECTORS (J2.2), [06] - CPU - HDMI, LVDS (U1.U2)
LVDS0_TX0_P: [03] - CONNECTORS (J2.4), [06] - CPU - HDMI, LVDS (U1.U1)
LVDS0_TX1_N: [03] - CONNECTORS (J2.8), [06] - CPU - HDMI, LVDS (U1.U4)
LVDS0_TX1_P: [03] - CONNECTORS (J2.10), [06] - CPU - HDMI, LVDS (U1.U3)
LVDS0_TX2_N: [03] - CONNECTORS (J2.1), [06] - CPU - HDMI, LVDS (U1.V2)
LVDS0_TX2_P: [03] - CONNECTORS (J2.3), [06] - CPU - HDMI, LVDS (U1.V1)
LVDS0_TX3_N: [03] - CONNECTORS (J2.7), [06] - CPU - HDMI, LVDS (U1.W2)
LVDS0_TX3_P: [03] - CONNECTORS (J2.9), [06] - CPU - HDMI, LVDS (U1.W1)
SD2_ACT: [03] - CONNECTORS (J2.11), [08] - CPU - SPI, I2C, SD, MMC (U1.T3)
SD2_CD: [03] - CONNECTORS (J2.38), [08] - CPU - SPI, I2C, SD, MMC (R42.1 U1.F16)
SD2_CLK: [03] - CONNECTORS (J2.36), [08] - CPU - SPI, I2C, SD, MMC (R66.2)
SD2_CMD: [03] - CONNECTORS (J2.21), [08] - CPU - SPI, I2C, SD, MMC (R41.1 R52.2)
SD2_DATA0: [03] - CONNECTORS (J2.26), [08] - CPU - SPI, I2C, SD, MMC (U1.A22)
SD2_DATA1: [03] - CONNECTORS (J2.23), [08] - CPU - SPI, I2C, SD, MMC (U1.E20)
SD2_DATA2: [03] - CONNECTORS (J2.28), [08] - CPU - SPI, I2C, SD, MMC (U1.A23)
SD2_DATA3: [03] - CONNECTORS (J2.25), [08] - CPU - SPI, I2C, SD, MMC (U1.B22)
SD2_DATA4: [03] - CONNECTORS (J2.30), [08] - CPU - SPI, I2C, SD, MMC (U1.A19)
SD2_DATA5: [03] - CONNECTORS (J2.27), [08] - CPU - SPI, I2C, SD, MMC (U1.B18)
SD2_DATA6: [03] - CONNECTORS (J2.32), [08] - CPU - SPI, I2C, SD, MMC (U1.E17)
SD2_DATA7: [03] - CONNECTORS (J2.29), [08] - CPU - SPI, I2C, SD, MMC (U1.C18)
SD2_WP: [03] - CONNECTORS (J2.34), [08] - CPU - SPI, I2C, SD, MMC (R43.1 U1.D17)
SD3_CD: [03] - CONNECTORS (J1.34), [08] - CPU - SPI, I2C, SD, MMC (R39.1 U1.A18)
SD3_CLK: [03] - CONNECTORS (J1.27), [08] - CPU - SPI, I2C, SD, MMC (R50.2)
SD3_CMD: [03] - CONNECTORS (J1.33), [08] - CPU - SPI, I2C, SD, MMC (R1.2 R38.1)
SD3_DATA0: [03] - CONNECTORS (J1.29), [08] - CPU - SPI, I2C, SD, MMC (U1.E14)
SD3_DATA1: [03] - CONNECTORS (J1.30), [08] - CPU - SPI, I2C, SD, MMC (U1.F14)
SD3_DATA2: [03] - CONNECTORS (J1.31), [08] - CPU - SPI, I2C, SD, MMC (U1.A15)
SD3_DATA3: [03] - CONNECTORS (J1.32), [08] - CPU - SPI, I2C, SD, MMC (U1.B15)
SD3_WP: [03] - CONNECTORS (J1.25), [08] - CPU - SPI, I2C, SD, MMC (R40.1 U1.C17)
UART1_CTS: [03] - CONNECTORS (J1.11), [09] - CPU - UART, AUDIO (U1.G21)
UART1_DCD: [03] - CONNECTORS (J1.16), [09] - CPU - UART, AUDIO (U1.D25)
UART1_DSR: [03] - CONNECTORS (J1.9), [09] - CPU - UART, AUDIO (U1.G22)
UART1_DTR: [03] - CONNECTORS (J1.15), [09] - CPU - UART, AUDIO (U1.F22)
UART1_RI: [03] - CONNECTORS (J1.10), [09] - CPU - UART, AUDIO (U1.F23)
UART1_RTS: [03] - CONNECTORS (J1.13), [09] - CPU - UART, AUDIO (U1.G20)
UART1_RXD: [03] - CONNECTORS (J1.14), [09] - CPU - UART, AUDIO (U1.M3)
UART1_TXD: [03] - CONNECTORS (J1.12), [09] - CPU - UART, AUDIO (U1.M1)
UART2_CTS: [03] - CONNECTORS (J2.31), [09] - CPU - UART, AUDIO (U1.B20)
UART2_RTS: [03] - CONNECTORS (J2.33), [09] - CPU - UART, AUDIO (U1.C19)
UART2_RXD: [03] - CONNECTORS (J2.35), [09] - CPU - UART, AUDIO (U1.E18)
UART2_TXD: [03] - CONNECTORS (J2.37), [09] - CPU - UART, AUDIO (U1.D19)
USB0_ID: [03] - CONNECTORS (J1.20), [07] - CPU - USB, ETHERNET (U1.T4)
USB0_N: [03] - CONNECTORS (J1.22), [07] - CPU - USB, ETHERNET (U1.B6)
USB0_P: [03] - CONNECTORS (J1.24), [07] - CPU - USB, ETHERNET (U1.A6)
USB0_PWR_EN: [03] - CONNECTORS (J1.26), [07] - CPU - USB, ETHERNET (U1.E23)
USB1_N: [03] - CONNECTORS (J2.40), [07] - CPU - USB, ETHERNET (U1.F10)
USB1_P: [03] - CONNECTORS (J2.42), [07] - CPU - USB, ETHERNET (U1.E10)
USB1_PWR_EN: [03] - CONNECTORS (J2.44), [07] - CPU - USB, ETHERNET (U1.H21)
USB_OC: [03] - CONNECTORS (J1.28), [07] - CPU - USB, ETHERNET (R100.1 U1.H20 U1.J20)

## Assembly variants
Prototype: not fitted FB8 Q5 Q8 Q9 R24 R51 R53 R54 R58 R65 R71 R77 R79 R87 R103 R105 R111 R117 R118 R120 R131 R133 R135 R137 R141 R142 R155 R156 R157